# Altium schematic sheet HM01_02_05_06_06_09.SCHDOC
size A4
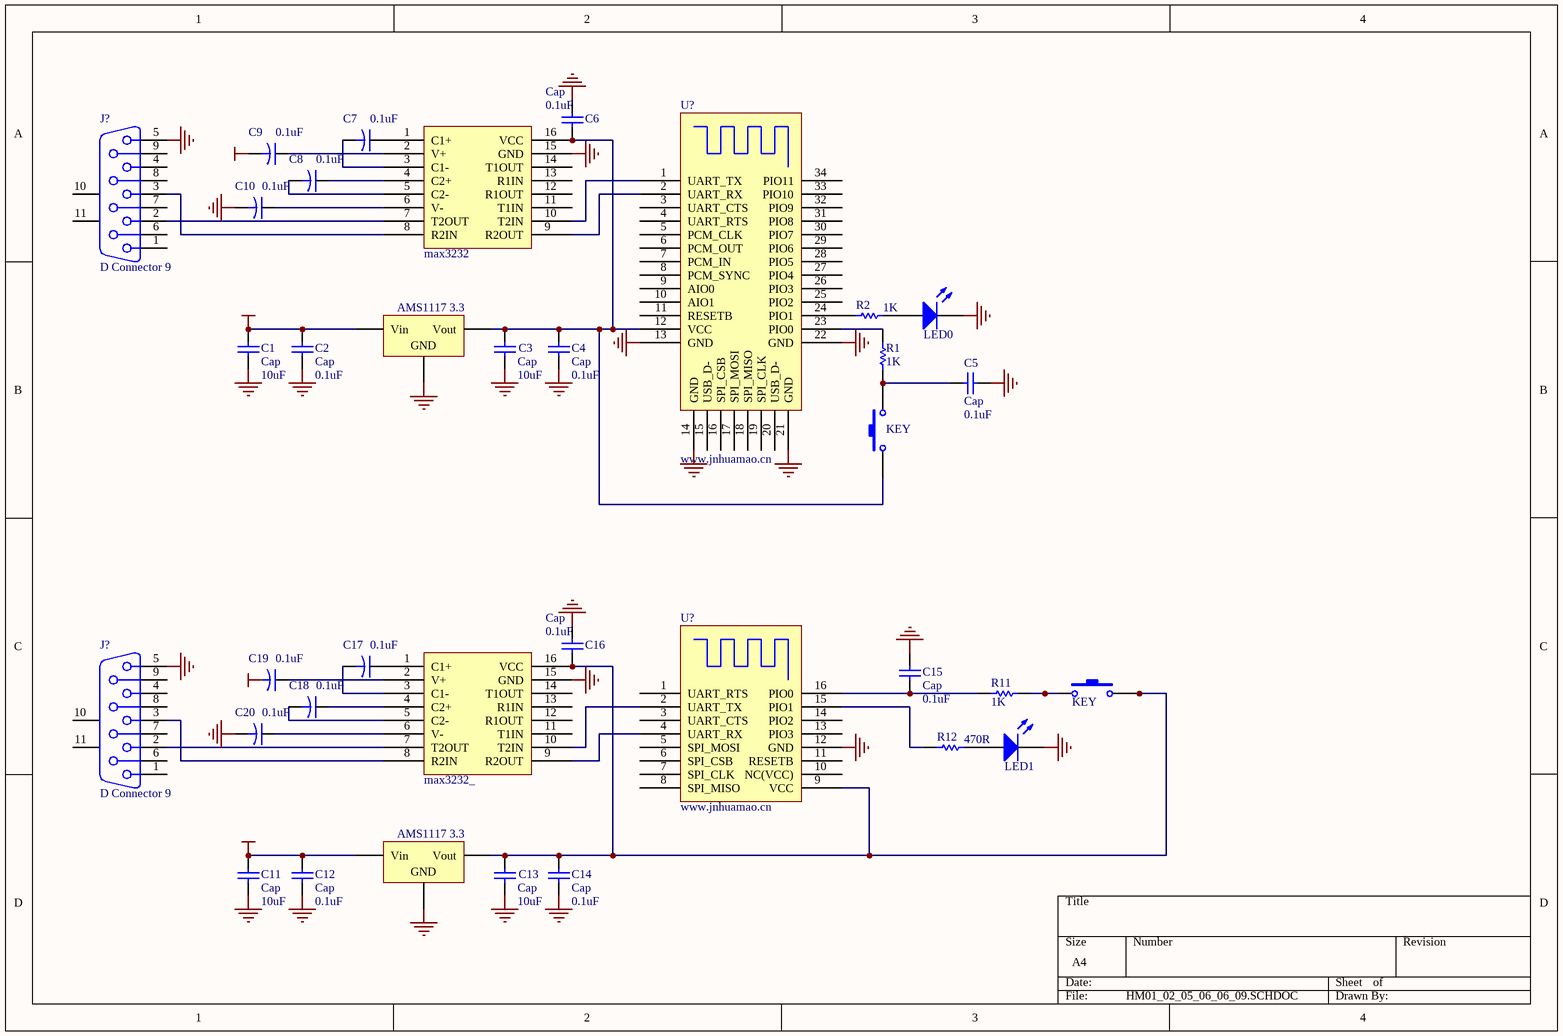
[diagram p0: HM01_02_05_06_06_09.SCHDOC]

## Parts
(Parts that share a designator on the sheet are numbered #1, #2 ... from top to bottom, then left to right.)
*  max3232
**  max3232_
C1  Cap  value 10uF  [CAPR2.54-5.1X3.2]
C2  Cap  value 0.1uF  [CAPR2.54-5.1X3.2]
C3  Cap  value 10uF  [CAPR2.54-5.1X3.2]
C4  Cap  value 0.1uF  [CAPR2.54-5.1X3.2]
C5  Cap  value 0.1uF  [CAPR2.54-5.1X3.2]
C6  Cap  value 0.1uF  [CAPR2.54-5.1X3.2]
C7  value 0.1uF  [CAPR5-4X5]  (hidden comment: Cap2)
C8  value 0.1uF  [CAPR5-4X5]  (hidden comment: Cap2)
C9  value 0.1uF  [CAPR5-4X5]  (hidden comment: Cap2)
C10  value 0.1uF  [CAPR5-4X5]  (hidden comment: Cap2)
C11  Cap  value 10uF  [CAPR2.54-5.1X3.2]
C12  Cap  value 0.1uF  [CAPR2.54-5.1X3.2]
C13  Cap  value 10uF  [CAPR2.54-5.1X3.2]
C14  Cap  value 0.1uF  [CAPR2.54-5.1X3.2]
C15  Cap  value 0.1uF  [CAPR2.54-5.1X3.2]
C16  Cap  value 0.1uF  [CAPR2.54-5.1X3.2]
C17  value 0.1uF  [CAPR5-4X5]  (hidden comment: Cap2)
C18  value 0.1uF  [CAPR5-4X5]  (hidden comment: Cap2)
C19  value 0.1uF  [CAPR5-4X5]  (hidden comment: Cap2)
C20  value 0.1uF  [CAPR5-4X5]  (hidden comment: Cap2)
DS?#1  LED0  [LED-0]
DS?#2  LED1  [LED-0]
J?#1  D Connector 9  [DSUB1.385-2H9]
J?#2  D Connector 9  [DSUB1.385-2H9]
R1  value 1K  [AXIAL-0.3]  (hidden comment: Res1)
R2  value 1K  [AXIAL-0.3]  (hidden comment: Res1)
R11  value 1K  [AXIAL-0.3]  (hidden comment: Res1)
R12  value 470R  [AXIAL-0.3]  (hidden comment: Res1)
S?#1  KEY  [SPST-2]
S?#2  KEY  [SPST-2]
U1  AMS1117 3.3  [SIP-G3/Y2]
U11  AMS1117 3.3  [SIP-G3/Y2]
U?#1  www.jnhuamao.cn
U?#2  www.jnhuamao.cn

## Nets
5V: C1.2 C2.2 C11.2 C12.2 U1.1(Vin) U11.1(Vin)
GND: *.15(GND) **.15(GND) C1.1 C2.1 C3.1 C4.1 C5.1 C6.1 C10.2 C11.1 C12.1 C13.1 C14.1 C15.1 C16.1 C20.2 DS?#1.2(K) DS?#2.2(K) J?#1.5 J?#2.5 U1.2(GND) U11.2(GND) U?#1.13(GND) U?#1.14(GND) U?#1.21(GND) U?#1.22(GND) U?#2.12(GND)
VCC: C9.2
Net**_1: **.1(C1+) C17.1
Net**_2: **.2(V+) C19.1
Net**_3: **.3(C1-) C17.2
Net**_4: **.4(C2+) C18.1
Net**_5: **.5(C2-) C18.2
Net**_6: **.6(V-) C20.1
Net**_7: **.7(T2OUT) J?#2.2
Net**_8: **.8(R2IN) J?#2.3
Net**_9: **.9(R2OUT) U?#2.4(UART_RX)
Net**_10: **.10(T2IN) U?#2.2(UART_TX)
Net**_16: **.16(VCC) C13.2 C14.2 C16.2 S?#2.2 U11.3(Vout) U?#2.9(VCC)
Net*_1: *.1(C1+) C7.1
Net*_2: *.2(V+) C9.1
Net*_3: *.3(C1-) C7.2
Net*_4: *.4(C2+) C8.1
Net*_5: *.5(C2-) C8.2
Net*_6: *.6(V-) C10.1
Net*_7: *.7(T2OUT) J?#1.2
Net*_8: *.8(R2IN) J?#1.3
Net*_9: *.9(R2OUT) U?#1.2(UART_RX)
Net*_10: *.10(T2IN) U?#1.1(UART_TX)
Net*_16: *.16(VCC) C3.2 C4.2 C6.2 S?#1.1 U1.3(Vout) U?#1.12(VCC)
NetC5_2: C5.2 R1.1 S?#1.2
NetC15_2: C15.2 R11.2 U?#2.16(PIO0)
NetDS?#1_1: DS?#1.1(A) R2.2
NetDS?#2_1: DS?#2.1(A) R12.2
NetR1_2: R1.2 U?#1.23(PIO0)
NetR2_1: R2.1 U?#1.24(PIO1)
NetR11_1: R11.1 S?#2.1
NetR12_1: R12.1 U?#2.15(PIO1)

Not connected (* = marked no-connect by the designer): * 11(T1IN) 12(R1OUT) 13(R1IN) 14(T1OUT); ** 11(T1IN) 12(R1OUT) 13(R1IN) 14(T1OUT); C19 2; J?#1 1 4 6 7 8 9 10(MH1) 11(MH2); J?#2 1 4 6 7 8 9 10(MH1) 11(MH2); U?#1 3(UART_CTS) 4(UART_RTS) 5(PCM_CLK) 6(PCM_OUT) 7(PCM_IN) 8(PCM_SYNC) 9(AIO0) 10(AIO1) 11(RESETB) 15(USB_D-) 16(SPI_CSB) 17(SPI_MOSI) 18(SPI_MISO) 19(SPI_CLK) 20(USB_D-) 25(PIO2) 26(PIO3) 27(PIO4) 28(PIO5) 29(PIO6) 30(PIO7) 31(PIO8) 32(PIO9) 33(PIO10) 34(PIO11); U?#2 1(UART_RTS) 3(UART_CTS) 5(SPI_MOSI) 6(SPI_CSB) 7(SPI_CLK) 8(SPI_MISO) 10(NC(VCC)) 11(RESETB) 13(PIO3) 14(PIO2)

## Notes on the sheet
- Labels drawn without touching a wire or pin: 3V3

## Library data of the parts
** = max3232
C1-C6 C11-C16 = Cap: Capacitor; Published: 8-Jun-2000; Revision: July-2002: Re-released for DXP Platform.; Publisher: Altium Limited
C7-C10 C17-C20 = Cap2: Capacitor; Published: 23-Sep-2002; Publisher: Altium Limited
DS?#1 DS?#2 = LED0: Typical INFRARED GaAs LED; Published: 8-Jun-2000; Revision: July-2002: Re-released for DXP Platform.; Publisher: Altium Limited
J?#1 J?#2 = D Connector 9: Receptacle Assembly, 9 Position, Right Angle; Package Information: Latest Revision: O; Positions: 9; Published: 15-Jun-2001; Revision: 17-Jul-2002: Re-released for DXP Platform.; Datasheet: (1-Sep-1999); Package Reference: 788750; Publisher: Altium Limited; Orientation: Right Angle; Gender: Receptacle
R1 R2 R11 R12 = Res1: Resistor; Published: 8-Jun-2000; Revision: July-2002: Re-released for DXP Platform.; Publisher: Altium Limited
S?#1 S?#2 = SW-PB: Switch; Published: 24-Mar-1999; Revision: July-2002: Re-released for DXP Platform.; Publisher: Altium Limited
U1 U11 = Volt Reg: Voltage Regulator; Code - JEDEC: SMD-220; Published: 24-Mar-1999; Revision: July-2002: Re-released for DXP Platform.; Publisher: Altium Limited
U?#1 = HM01_02_09_1: HM bluetooth module HM-01,HM-02,HM-09
U?#2 = HM_05_06_07_11: HM bluetooth module HM-05,HM-06,HM-07, HM-11